# EAGLE schematic opengarden_remote_v1 (EAGLE 6.1)
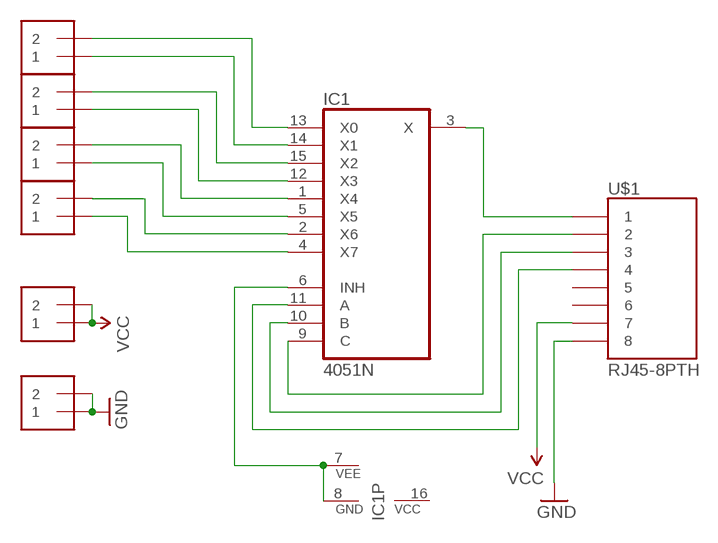
[diagram p0: schematic, sheet 1]

## Parts
IC1  4051N  [DIL16]
J1  1X2-3.5MM  [1X2-3.5MM]
J2  1X2-3.5MM  [1X2-3.5MM]
J3  1X2-3.5MM  [1X2-3.5MM]
J4  1X2-3.5MM  [1X2-3.5MM]
J9  1X2-3.5MM  [1X2-3.5MM]
J10  1X2-3.5MM  [1X2-3.5MM]
U$1  RJ45-8PTH  [RJ45-8]

## Nets
GND: J4.1 J4.2 U$1.8
N$1: IC1.13(X0) J1.2
N$2: IC1.14(X1) J1.1
N$3: IC1.15(X2) J2.2
N$4: IC1.12(X3) J2.1
N$5: IC1.1(X4) J3.2
N$7: IC1.5(X5) J3.1
N$8: IC1.2(X6) J9.2
N$9: IC1.4(X7) J9.1
N$43: IC1.3(X) U$1.1
N$44: IC1.9(C) U$1.2
N$45: IC1.10(B) U$1.3
N$46: IC1.11(A) U$1.4
N$47: IC1.6(INH) IC1.7(VEE) IC1.8(GND)
VCC: J10.1 J10.2 U$1.7
Unconnected: U$1.5 U$1.6

## Power pins joined to a net without a drawn wire
VCC: IC1.16(VCC)

## Library data of the parts
IC1 = 40xx:4051: 8-channel ANALOG MULTIPLEXER
J1-J4 J9 J10 = adafruit:1X2: 3.5mm Terminal block http://www.ladyada.net/library/pcb/eaglelibrary.html
U$1 = SparkFun-Connectors:RJ45-8: RJ45 Jack Simple RJ45, 8-pin connection - connector for common Cat5, Cat5e, and Cat6 Ethernet cables. Footprint not yet proven in production. Connector sku is PRT-00643; Breakout PCB sku is BOB-00716.